# Altium schematic sheet XSB.SchDoc
size A
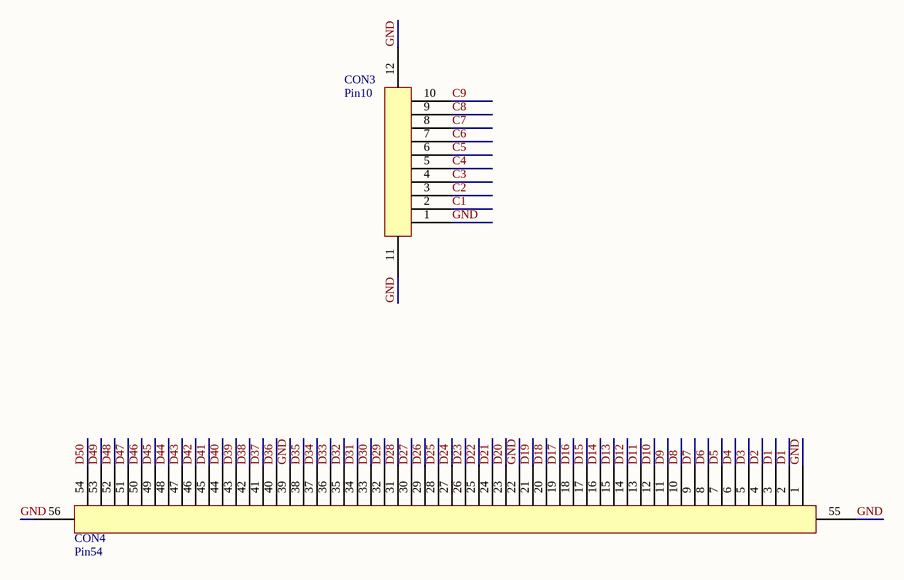
[diagram p0: XSB.SchDoc]

## Parts
CON3  Pin10  [Pin10]
CON4  Pin54  [Pin54]

## Nets
C1: CON3.2
C2: CON3.3
C3: CON3.4
C4: CON3.5
C5: CON3.6
C6: CON3.7
C7: CON3.8
C8: CON3.9
C9: CON3.10
D1: CON4.2 CON4.3
D2: CON4.4
D3: CON4.5
D4: CON4.6
D5: CON4.7
D6: CON4.8
D7: CON4.9
D8: CON4.10
D9: CON4.11
D10: CON4.12
D11: CON4.13
D12: CON4.14
D13: CON4.15
D14: CON4.16
D15: CON4.17
D16: CON4.18
D17: CON4.19
D18: CON4.20
D19: CON4.21
D20: CON4.23
D21: CON4.24
D22: CON4.25
D23: CON4.26
D24: CON4.27
D25: CON4.28
D26: CON4.29
D27: CON4.30
D28: CON4.31
D29: CON4.32
D30: CON4.33
D31: CON4.34
D32: CON4.35
D33: CON4.36
D34: CON4.37
D35: CON4.38
D36: CON4.40
D37: CON4.41
D38: CON4.42
D39: CON4.43
D40: CON4.44
D41: CON4.45
D42: CON4.46
D43: CON4.47
D44: CON4.48
D45: CON4.49
D46: CON4.50
D47: CON4.51
D48: CON4.52
D49: CON4.53
D50: CON4.54
GND: CON3.1 CON3.11 CON3.12 CON4.1 CON4.22 CON4.39 CON4.55 CON4.56